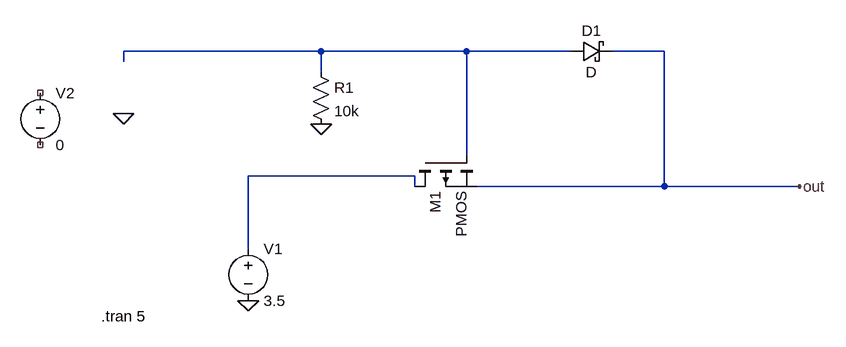
[diagram p0: schematic switch.asc]
switch.asc, the LTspice schematic file:
Version 4
SHEET 1 880 680
WIRE 0 16 -304 16
WIRE 224 16 0 16
WIRE 384 16 224 16
WIRE 528 16 448 16
WIRE -304 32 -304 16
WIRE 0 48 0 16
WIRE 224 176 224 16
WIRE 144 208 -112 208
WIRE 144 224 144 208
WIRE 528 224 528 16
WIRE 528 224 240 224
WIRE 736 224 528 224
WIRE -112 320 -112 208
FLAG -304 112 0
FLAG -112 400 0
FLAG 0 128 0
FLAG 736 224 out
SYMBOL pmos 144 176 M90
SYMATTR InstName M1
SYMBOL schottky 384 32 R270
WINDOW 0 32 32 VTop 2
WINDOW 3 0 32 VBottom 2
SYMATTR InstName D1
SYMBOL voltage -112 304 R0
WINDOW 123 0 0 Left 0
WINDOW 39 0 0 Left 0
SYMATTR InstName V1
SYMATTR Value 3.5
SYMBOL voltage -432 64 R0
WINDOW 123 0 0 Left 0
WINDOW 39 0 0 Left 0
SYMATTR InstName V2
SYMATTR Value 0
SYMBOL res -16 32 R0
SYMATTR InstName R1
SYMATTR Value 10k
TEXT -338 424 Left 2 !.tran 5

The netlist it stands for:
* switch.asc
M1 N002 N001 out out PMOS
D1 N001 out D
V1 N002 0 3.5
V2 NC_01 NC_02 0
R1 N001 0 10k
.model D D
.lib standard.dio
.model NMOS NMOS
.model PMOS PMOS
.lib standard.mos
.tran 5
.backanno
.end